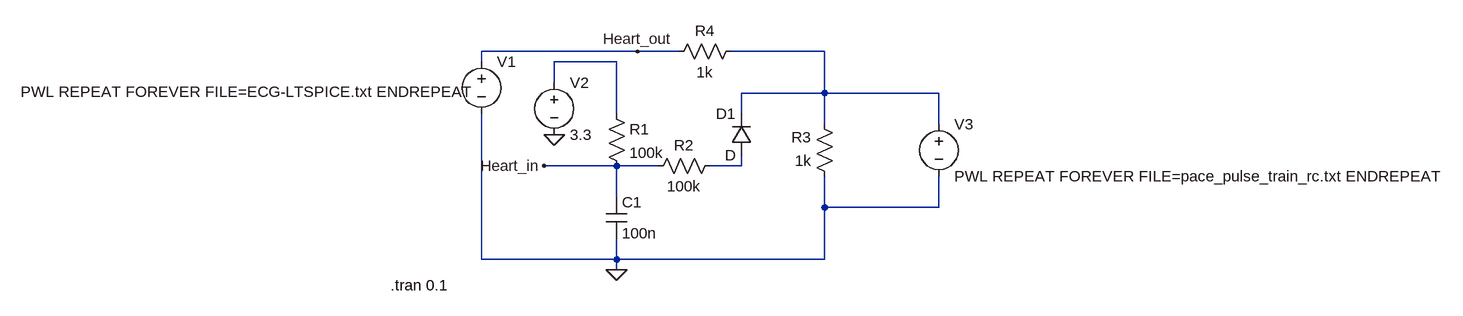
[diagram p0: schematic pace_input_circuit.asc]
pace_input_circuit.asc, the LTspice schematic file:
Version 4
SHEET 1 1464 680
WIRE 208 32 -32 32
WIRE 272 32 208 32
WIRE 496 32 352 32
WIRE -32 48 -32 32
WIRE 176 48 80 48
WIRE 80 80 80 48
WIRE 496 96 496 32
WIRE 496 96 368 96
WIRE 672 96 496 96
WIRE 176 128 176 48
WIRE 368 128 368 96
WIRE 496 144 496 96
WIRE 672 144 672 96
WIRE 176 208 64 208
WIRE 240 208 176 208
WIRE 368 208 368 192
WIRE 368 208 320 208
WIRE 176 256 176 208
WIRE 496 272 496 224
WIRE 672 272 672 224
WIRE 672 272 496 272
WIRE -32 352 -32 128
WIRE 176 352 176 320
WIRE 176 352 -32 352
WIRE 496 352 496 272
WIRE 496 352 176 352
WIRE 176 368 176 352
FLAG 80 160 0
FLAG 176 368 0
FLAG 64 208 Heart_in
FLAG 208 32 Heart_out
SYMBOL res 160 112 R0
SYMATTR InstName R1
SYMATTR Value 100k
SYMBOL res 336 192 R90
WINDOW 0 0 56 VBottom 2
WINDOW 3 32 56 VTop 2
SYMATTR InstName R2
SYMATTR Value 100k
SYMBOL res 512 240 R180
WINDOW 0 36 76 Left 2
WINDOW 3 36 40 Left 2
SYMATTR InstName R3
SYMATTR Value 1k
SYMBOL res 256 48 R270
WINDOW 0 32 56 VTop 2
WINDOW 3 0 56 VBottom 2
SYMATTR InstName R4
SYMATTR Value 1k
SYMBOL cap 160 256 R0
SYMATTR InstName C1
SYMATTR Value 100n
SYMBOL diode 384 192 R180
WINDOW 0 24 64 Left 2
WINDOW 3 24 0 Left 2
SYMATTR InstName D1
SYMBOL voltage -32 32 R0
WINDOW 3 -709 62 Left 2
WINDOW 123 0 0 Left 0
WINDOW 39 0 0 Left 0
SYMATTR InstName V1
SYMATTR Value PWL REPEAT FOREVER FILE=ECG-LTSPICE.txt ENDREPEAT
SYMBOL voltage 80 64 R0
WINDOW 123 0 0 Left 0
WINDOW 39 0 0 Left 0
SYMATTR InstName V2
SYMATTR Value 3.3
SYMBOL voltage 672 128 R0
WINDOW 123 0 0 Left 0
WINDOW 39 0 0 Left 0
SYMATTR InstName V3
SYMATTR Value PWL REPEAT FOREVER FILE=pace_pulse_train_rc.txt ENDREPEAT
TEXT -172 392 Left 2 !.tran 0.1

The netlist it stands for:
* pace_input_circuit.asc
R1 N002 Heart_in 100k
R2 N003 Heart_in 100k
R3 0 N001 1k
R4 Heart_out N001 1k
C1 Heart_in 0 100n
D1 N003 N001 D
V1 Heart_out 0 PWL REPEAT FOREVER FILE=ECG-LTSPICE.txt ENDREPEAT
V2 N002 0 3.3
V3 N001 0 PWL REPEAT FOREVER FILE=pace_pulse_train_rc.txt ENDREPEAT
.model D D
.lib standard.dio
.tran 0.1
.backanno
.end